# Altium project tsac-distribution.PrjPcb (part 2 of 2)

## Sheet tsal-logic.SchDoc: tsal-logic
size A4; Date: 05.10.2017; CheckedBy: Nico Bieberich; Author: Leon Loeser; Organization: Baltic Racing; Address1: Zur Schwedenschanze 15; Address2: Haus 18; Address3: 18435 Stralsund; Revision: xx.xx; SheetNumber: 4; SheetTotal: 9; Rules: EV4.10; ProjectName: Projekt
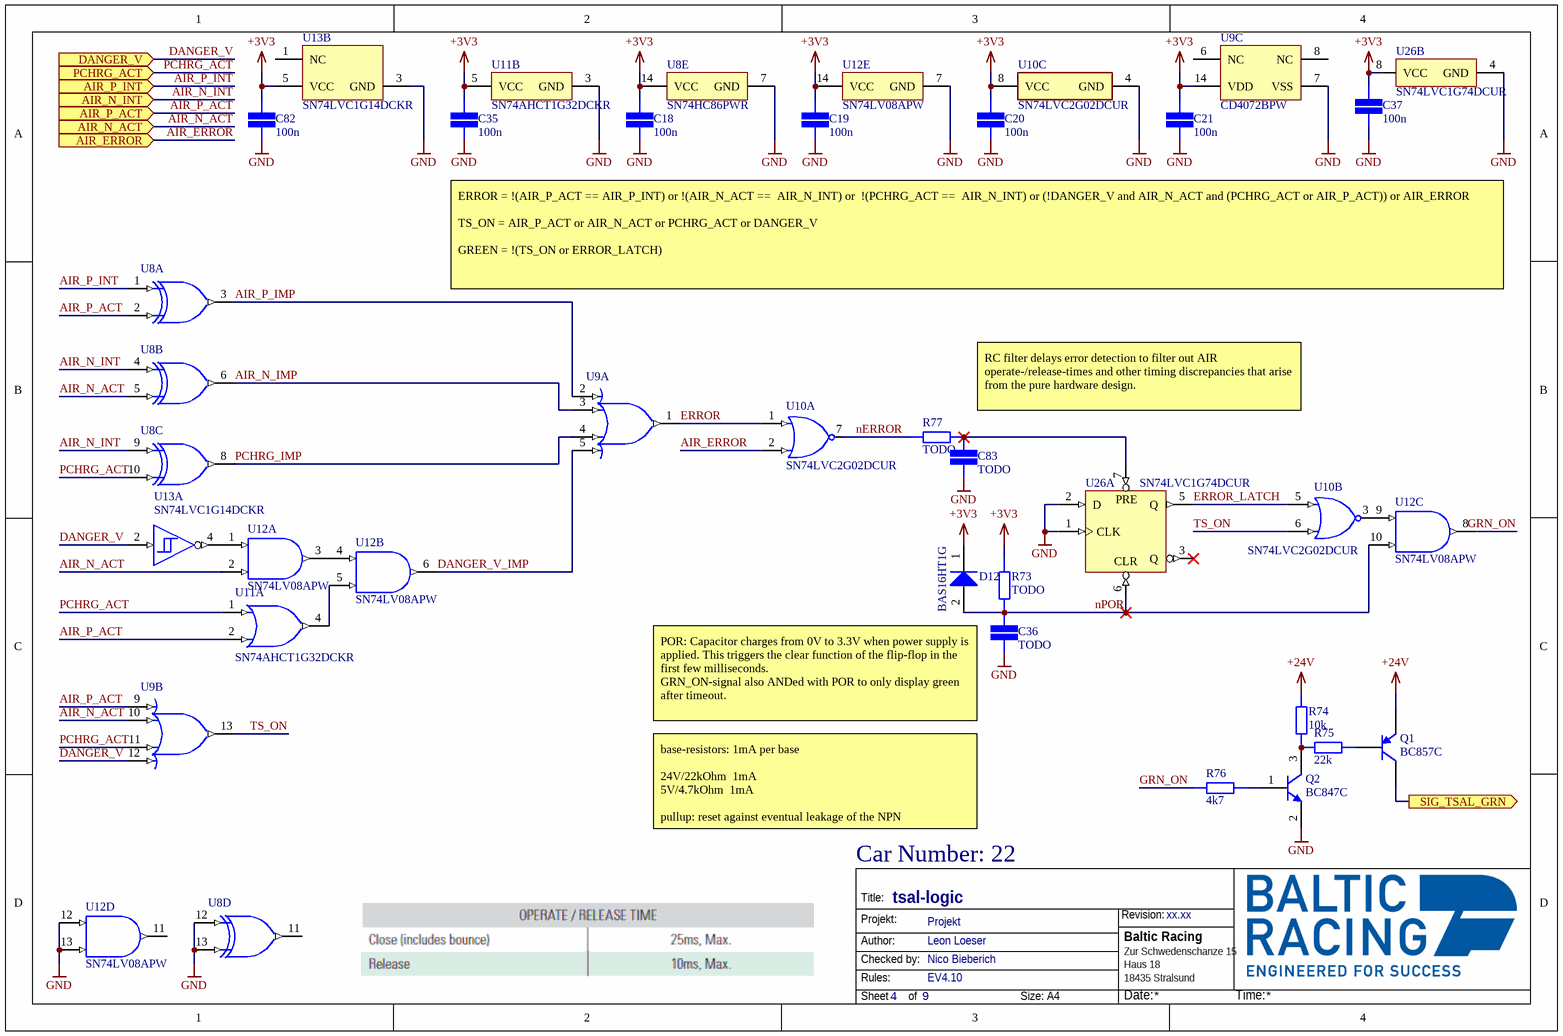
[diagram p6: tsal-logic.SchDoc]

### Parts
C18  value 100n  [CAP 0603/1608]  (hidden comment: SMD Capacitor)
C19  value 100n  [CAP 0603/1608]  (hidden comment: SMD Capacitor)
C20  value 100n  [CAP 0603/1608]  (hidden comment: SMD Capacitor)
C21  value 100n  [CAP 0603/1608]  (hidden comment: SMD Capacitor)
C35  value 100n  [CAP 0603/1608]  (hidden comment: SMD Capacitor)
C36  value TODO  [CAP 1206/3216]  (hidden comment: SMD Capacitor)
C37  value 100n  [CAP 0603/1608]  (hidden comment: SMD Capacitor)
C82  value 100n  [CAP 0603/1608]  (hidden comment: SMD Capacitor)
C83  value TODO  [CAP 1206/3216]  (hidden comment: SMD Capacitor)
D12  BAS16HT1G  [ONSC-SOD-323-2-477-02_V]
Q1  BC857C  [INF-SOT23_N]
Q2  BC847C  [INF-SOT23_L]
R73  value TODO  [STACKPOLE CSR0603]  (hidden comment: SMD Resistor)
R74  value 10k  [STACKPOLE CSR0603]  (hidden comment: SMD Resistor)
R75  value 22k  [STACKPOLE CSR0603]  (hidden comment: SMD Resistor)
R76  value 4k7  [STACKPOLE CSR0603]  (hidden comment: SMD Resistor)
R77  value TODO  [STACKPOLE CSR0603]  (hidden comment: SMD Resistor)
U8  SN74HC86PWR  [PW0014A_M]  (value not drawn)  (parts A,B,C,D,E of 5)
U9  CD4072BPW  [PW0014A_M]  (value not drawn)  (parts A,B,C of 3)
U10  SN74LVC2G02DCUR  [FP-DCU0008A-MFG]  (parts A,B,C of 3)
U11  SN74AHCT1G32DCKR  [DCK0005A_M]  (parts A,B of 2)
U12  SN74LV08APW  [PW0014A_N]  (parts A,B,C,D,E of 5)
U13  SN74LVC1G14DCKR  [DCK0005A_L]  (parts A,B of 2)
U26  SN74LVC1G74DCUR  [DCU0008A_L]  (parts A,B of 2)

### Ports
AIR_ERROR (in), AIR_N_ACT (in), AIR_N_INT (in), AIR_P_ACT (in), AIR_P_INT (in), DANGER_V (in), PCHRG_ACT (in), SIG_TSAL_GRN (out)

### Nets
+3V3: C18.1 C19.1 C20.1 C21.1 C35.1 C37.1 C82.1 D12.1(K) R73.2 U8.14(VCC) U9.14(VDD) U10.8(VCC) U11.5(VCC) U12.14(VCC) U13.5(VCC) U26.8(VCC)
+24V: Q1.2(E) R74.1
GND: C18.2 C19.2 C20.2 C21.2 C35.2 C36.1 C37.2 C82.2 C83.1 Q2.2(E) U8.7(GND) U8.12(4A) U8.13(4B) U9.7(VSS) U10.4(GND) U11.3(GND) U12.7(GND) U12.12(4A) U12.13(4B) U13.3(GND) U26.1(CLK) U26.2(D) U26.4(GND)
AIR_ERROR: U10.2(1B) ; port AIR_ERROR
AIR_N_ACT: U8.5(2B) U9.10(F) U12.2(1B) ; port AIR_N_ACT
AIR_N_IMP: U8.6(2Y) U9.3(B)
AIR_N_INT: U8.4(2A) U8.9(3A) ; port AIR_N_INT
AIR_P_ACT: U8.2(1B) U9.9(E) U11.2(B) ; port AIR_P_ACT
AIR_P_IMP: U8.3(1Y) U9.2(A)
AIR_P_INT: U8.1(1A) ; port AIR_P_INT
DANGER_V: U9.12(H) U13.2(A) ; port DANGER_V
DANGER_V_IMP: U9.5(D) U12.6(2Y)
ERROR: U9.1(J) U10.1(1A)
ERROR_LATCH: U10.5(2A) U26.5(Q)
GRN_ON: R76.2 U12.8(3Y)
nERROR: R77.2 U10.7(1Y)
nPOR: C36.2 D12.2(A) R73.1 U12.10(3B) U26.6(~{CLR})
PCHRG_ACT: U8.10(3B) U9.11(G) U11.1(A) ; port PCHRG_ACT
PCHRG_IMP: U8.8(3Y) U9.4(C)
SIG_TSAL_GRN: Q1.3(C) ; port SIG_TSAL_GRN
TS_ON: U9.13(K) U10.6(2B)
NetC83_2: C83.2 R77.1 U26.7(~{PRE})
NetQ1_1: Q1.1(B) R75.1
NetQ2_1: Q2.1(B) R76.1
NetQ2_3: Q2.3(C) R74.2 R75.2
NetU10_3: U10.3(2Y) U12.9(3A)
NetU11_4: U11.4(Y) U12.5(2B)
NetU12_1: U12.1(1A) U13.4(Y)
NetU12_3: U12.3(1Y) U12.4(2A)

Not connected (* = marked no-connect by the designer): U8 11(4Y); U9 6(NC) 8(NC); U12 11(4Y); U13 1(NC); U26 3(Q)*

### Notes on the sheet
- ERROR = !(AIR_P_ACT == AIR_P_INT) or !(AIR_N_ACT ==  AIR_N_INT) or  !(PCHRG_ACT ==  AIR_N_INT) or (!DANGER_V and AIR_N_ACT and (PCHRG_ACT or AIR_P_ACT)) or AIR_ERROR
  TS_ON = AIR_P_ACT or AIR_N_ACT or PCHRG_ACT or DANGER_V
  GREEN = !(TS_ON or ERROR_LATCH)
- RC filter delays error detection to filter out AIR operate-/release-times and other timing discrepancies that arise from the pure hardware design.
- POR: Capacitor charges from 0V to 3.3V when power supply is applied. This triggers the clear function of the flip-flop in the first few milliseconds.
  GRN_ON-signal also ANDed with POR to only display green after timeout.
- base-resistors: 1mA per base
  24V/22kOhm  1mA
  5V/4.7kOhm  1mA
  pullup: reset against eventual leakage of the NPN
- Car Number: 22
- Title:
- Projekt:
- Revision:
- Author:
- Rules:
- Checked by:
- Sheet
- of
- Size:
- A4
- Date:
- Time:
- (in symbol CMP-0859-00701-3, part A) PRE; CLR

### Library data of the parts
C18-C21 C35-C37 C82 C83 = SMD Capacitor: as C53 on sheet tsac-distribution
D12 = CMP-1054-00068-1: Switching Diode, 2-Pin SOD-323, Pb-Free, Tape and Reel; Manufacturer: On Semiconductor; Configuration: Single; IF Max (A): 0.2; trr Max (ns): 6; Packing: Tape and Reel; ComponentLink2URL: http://www.onsemi.com/pub_link/Collateral/BAS16HT1-D.PDF; ComponentLink3Description: Package Specification; RoHS: TRUE; PackageDescription: 2-Pin SOD, Body 1.7 x 1.25 mm; PackageReference: SOD-323-2-477-02; PartNumber: BAS16HT1G; ComponentLink1URL: http://www.onsemi.com/; Mounting Technology: Surface Mount; ComponentLink1Description: Manufacturer URL; ComponentLink2Description: Datasheet; DatasheetVersion: Rev. 11; PackageVersion: Rev. H, 03/2007; ComponentLink3URL: http://www.onsemi.com/pub_link/Collateral/477-02.PDF.1
Q1 = CMP-1177-00039-1: PNP Silicon AF Transistor, 45 V VCEO, 100 mA IC, SOT23, Reel, Green; Manufacturer: Infineon; VCBO (max): 50Â V; fT (typ): 250Â MHz; ICBO (max): 15Â nA; IC (max): 100Â mA; Green: TRUE; IBM (max): 200Â mA; VEBO (max): 5Â V; VCEO (max): 45Â V; Ptot (max): 330Â mW; PackageDescription: 3-Pin Small Outline Transistor Package, 1.3 x 2.9 mm Body, 0.95 mm Pitch; ComponentLink2Description: Datasheet; PackageReference: SOT23; ComponentLink3Description: Package Specification; ComponentLink1URL: http://www.infineon.com/; ComponentLink1Description: Manufacturer URL; Mounting Technology: Surface Mount; PackageVersion: Apr-08; ComponentLink3URL: http://www.infineon.com/dgdl/SOT23-Package_Overview.pdf?folderId=db3a30431936bc4b0119532290053c66&fileId=db3a30431936bc4b0119533468123c85; ComponentLink2URL: http://www.infineon.com/dgdl/bc857series_bc858series_bc859series_bc860series.pdf?folderId=db3a304314dca389011541d30fa21656&fileId=db3a304314dca389011541da0e3a1661; Polarity: PNP; ICM (max): 200Â mA; PartNumber: BC857C; Packing: Reel
Q2 = CMP-1177-00037-1: NPN Silicon AF Transistor, 45 V VCEO, 100 mA IC, SOT23, Reel, Green; Manufacturer: Infineon; VCEO (max): 45Â V; VEBO (max): 6Â V; fT (typ): 250Â MHz; VCBO (max): 50Â V; ICM (max): 200Â mA; Green: TRUE; IC (max): 100Â mA; Ptot (max): 330Â mW; ICBO (max): 15Â nA; PartNumber: BC847C; ComponentLink3URL: http://www.infineon.com/dgdl/SOT23-Package_Overview.pdf?folderId=db3a30431936bc4b0119532290053c66&fileId=db3a30431936bc4b0119533468123c85; ComponentLink3Description: Package Specification; Mounting Technology: Surface Mount; PackageDescription: 3-Pin Small Outline Transistor Package, 1.3 x 2.9 mm Body, 0.95 mm Pitch; PackageReference: SOT23; ComponentLink2URL: http://www.infineon.com/dgdl/bc847series_bc848series_bc849series_bc850series.pdf?folderId=db3a304314dca389011541d30fa21656&fileId=db3a304314dca389011541d4630a1657; ComponentLink2Description: Datasheet; ComponentLink1Description: Manufacturer URL; Polarity: NPN; ComponentLink1URL: http://www.infineon.com/; IBM (max): 200Â mA; Packing: Reel; PackageVersion: Apr-08
R73-R77 = SMD Resistor: Resistor with multiple footprints
U8 = CMP-0778-00135-3: Quadruple 2-Input Exclusive-OR Gates, PW0014A, LARGE T&R; Manufacturer: Texas Instruments; Technology Family: HC; tpd @ Nom Voltage(Max)(ns): 21; Schmitt Trigger: No; Bits(#): 4; Output Drive (IOL/IOH)(Max)(mA): 5.2/-5.2; Rating: Catalog; Input Type: CMOS; Voltage(Nom)(V): 5; ICC @ Nom Voltage(Max)(mA): 0.02; VCC(Min)(V): 2; VCC(Max)(V): 6; F @ Nom Voltage(Max)(Mhz): 70; Generic Part Number: SN74HC86; Operating Temperature Range(C): -40 to 85; PackageReference: PW0014A; DatasheetVersion: SCLS100E; Output Type: CMOS
U9 = CMP-1573-00202-3: CMOS Dual 4-Input OR Gate, PW0014A, TUBE; Manufacturer: Texas Instruments; Voltage(Nom)(V): 10; tpd @ Nom Voltage(Max)(ns): 120; Rating: Catalog; VCC(Max)(V): 18; ICC @ Nom Voltage(Max)(mA): 0.015; VCC(Min)(V): 3; Output Drive (IOL/IOH)(Max)(mA): 1.5/-1.5; F @ Nom Voltage(Max)(Mhz): 8; Bits(#): 2; Code_JEDEC: MO-153; Output Type: CMOS; Input Type: CMOS; PackageReference: PW0014A; Generic Part Number: CD4072B; Operating Temperature Range(C): -55 to 125; DatasheetVersion: SCHS056D; PackageVersion: http://www.ti.com/lit/ml/mpds360/mpds360.pdf
U10 = CMP-0859-00696-4: NOR Gate IC 2 Channel  8-VSSOP; Manufacturer: Texas Instruments; Max Supply Voltage: 5.5V; Number Of Circuits: 2; Nominal Supply Current: 10uA; Number Of Outputs: 1; Standoff Height: 0mm; Max Junction Temp: +150°C; Min Supply Voltage: 1.65V; Propagation Delay: 5.4ns; Frequency: 100MHz; RoHS: TRUE; Device Class L2: Logic ICs; Device Class L3: Logic Gates; Device Class L1: Integrated Circuits (ICs); Manufacturer Part Number: SN74LVC2G02DCUR; Automotive: No; Octopart: https://octopart.com/sn74lvc2g02dcur-texas+instruments-464558; Logic Function Desc: NOR; Temperature Range Low: -40°C; Number Of Inputs: 2; Ambient Temperature Range High: +125°C; Package: DCU0008A; ComponentLink2Description: Datasheet; Mouser Description: Dual 2-Input Positive-NOR Gate 8-VSSOP -40 to 125; Ambient Temperature Range Low: -40°C; Category: IC; Temperature Range High: +125°C; Temperature: -40°C to +125°C; Lead Free: Yes; ComponentLink2URL: http://www.ti.com/lit/ds/symlink/sn74lvc2g02.pdf; Height: 0.9mm; Digikey Description: NOR Gate IC 2 Channel  8-VSSOP
U11 = CMP-0859-00275-3: Single 2-Input Positive-OR Gate, DCK0005A, LARGE T&R; Manufacturer: Texas Instruments; Logic: True; Output Drive (IOL/IOH)(Max)(mA): 8/-8; VCC(Min)(V): 2; Input Type: CMOS; ICC @ Nom Voltage(Max)(mA): 0.01; tpd @ Nom Voltage(Max)(ns): 8; Bits(#): 1; Voltage(Nom)(V): 5; VCC(Max)(V): 5.5; Technology Family: AHCT; Rating: Catalog; Sub-Family: OR Gate; Gate Type: OR; F @ Nom Voltage(Max)(Mhz): 75; 3-State Output: No; PackageReference: DCK0005A; Output Type: CMOS; DatasheetVersion: SCLS320O; Operating Temperature Range(C): -40 to 125; Generic Part Number: SN74AHCT1G32; Schmitt Trigger: No
U12 = CMP-0777-00327-3: Quadruple 2-Input Positive-AND Gates, PW0014A, TUBE; Manufacturer: Texas Instruments; Output Type: TTL; VCC(Min)(V): 2; Schmitt Trigger: No; Bits(#): 4; Rating: Catalog; F @ Nom Voltage(Max)(Mhz): 70; Output Drive (IOL/IOH)(Max)(mA): -50/50; tpd @ Nom Voltage(Max)(ns): 16,10.5,7; Voltage(Nom)(V): 2.5,3.3,5; VCC(Max)(V): 5.5; ICC @ Nom Voltage(Max)(mA): 0.02; Technology Family: LV-A; DatasheetVersion: SCLS387M; Input Type: TTL; PackageReference: PW0014A; Operating Temperature Range(C): -40 to 125,-40 to 85; Generic Part Number: SN74LV08A
U13 = CMP-0859-00440-4: Single Schmitt-Trigger Inverter, DCK0005A, LARGE T&R; Manufacturer: Texas Instruments; Output Drive (IOL/IOH)(Max)(mA): 32/-32; Schmitt Trigger: Yes; Logic: Inverting; Bits(#): 1; Rating: Catalog; tpd @ Nom Voltage(Max)(ns): 11,6.5,5.5,5; Voltage(Nom)(V): 1.8,2.5,3.3,5; Output Type: CMOS; VCC(Min)(V): 1.65; ICC @ Nom Voltage(Max)(mA): 0.01; Input Type: CMOS/TTL; F @ Nom Voltage(Max)(Mhz): 150; VCC(Max)(V): 5.5; Sub-Family: Inverting Buffer/Driver; 3-State Output: No; Technology Family: LVC; PackageReference: DCK0005A; Operating Temperature Range(C): -40 to 125,-40 to 85; Generic Part Number: SN74LVC1G14; DatasheetVersion: SCES218W
U26 = CMP-0859-00701-3: Single Positive-Edge-Triggered D-Type Flip-Flop With Clear and Preset, DCU0008A, LARGE T&R; Manufacturer: Texas Instruments; Rating: Catalog; Technology Family: LVC; Output Type: CMOS; VCC(Max)(V): 5.5; ICC @ Nom Voltage(Max)(mA): 0.01; Output Drive (IOL/IOH)(Max)(mA): 32/-32; 3-State Output: No; VCC(Min)(V): 1.65; Input Type: CMOS/TTL; Logic: True; Bits(#): 1; Voltage(Nom)(V): 1.8,2.5,3.3,5; tpd @ Nom Voltage(Max)(ns): 13.4,7.1,5.9,4.1; F @ Nom Voltage(Max)(Mhz): 150; PackageReference: DCU0008A; Sub-Family: D-Type Flip-Flop; Schmitt Trigger: No; DatasheetVersion: SCES794E; Generic Part Number: SN74LVC1G74; Operating Temperature Range(C): -40 to 125

## Sheet precharge.SchDoc: precharge
size A4; Date: 05.10.2017; CheckedBy: Nico Bieberich; Author: Leon Loeser; Organization: Baltic Racing; Address1: Zur Schwedenschanze 15; Address2: Haus 18; Address3: 18435 Stralsund; Revision: xx.xx; SheetNumber: 6; SheetTotal: 9; Rules: EV5.7; ProjectName: Projekt
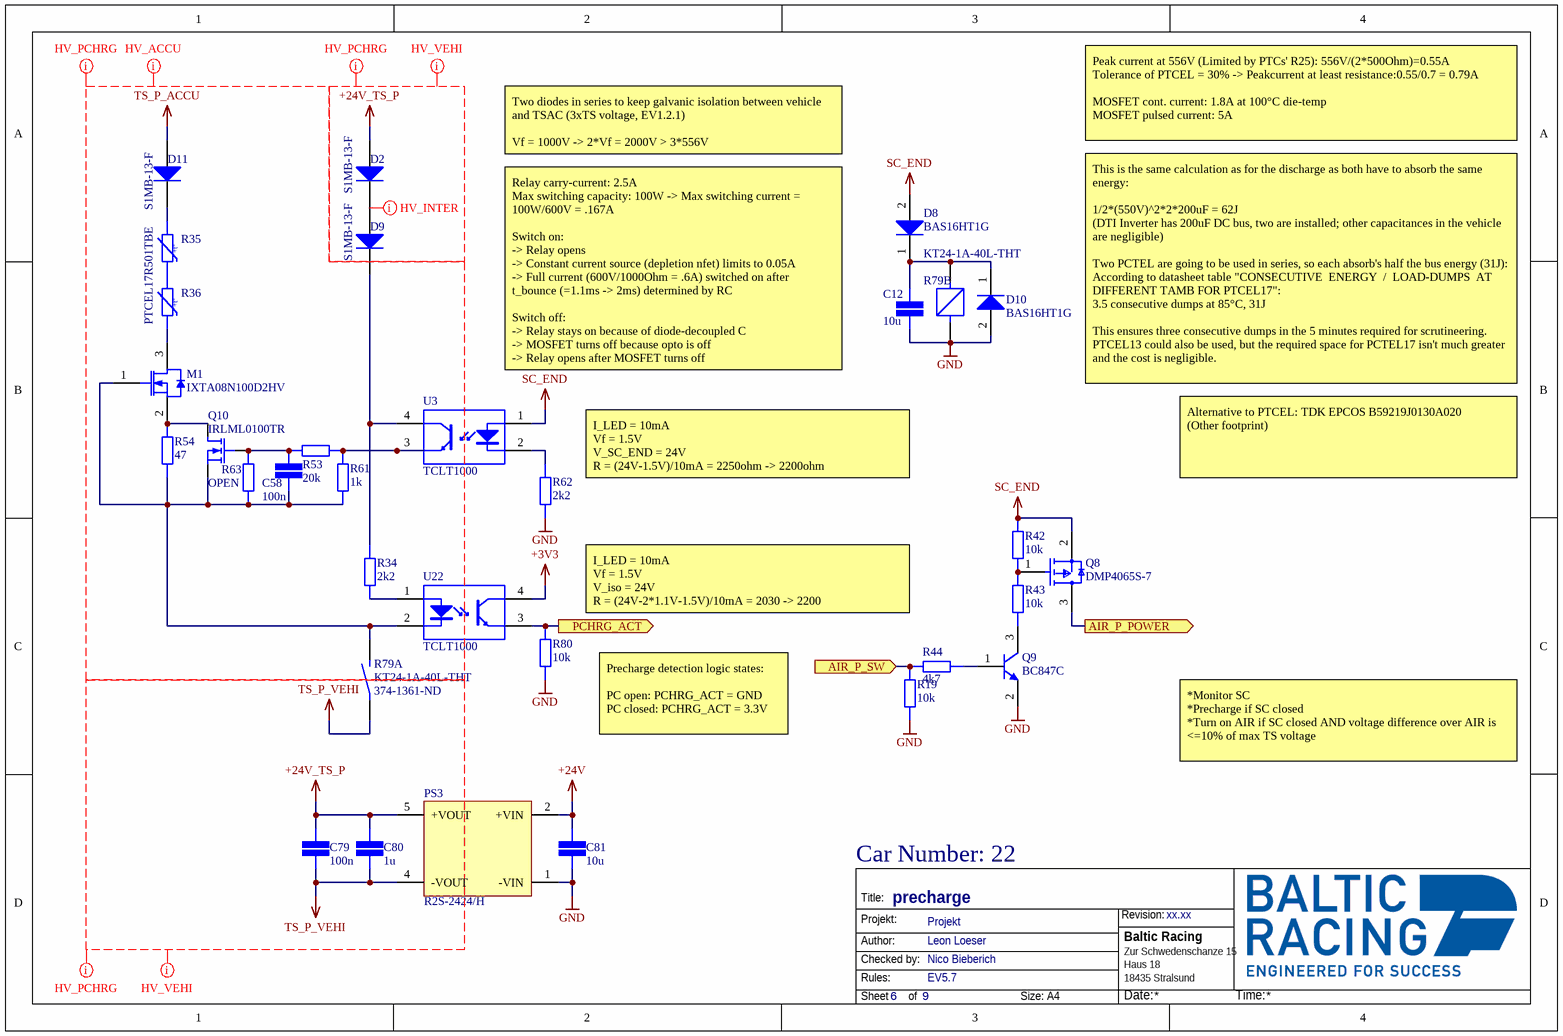
[diagram p7: precharge.SchDoc]

### Parts
C12  value 10u  [CAP 1206/3216]  (hidden comment: SMD Capacitor)
C58  value 100n  [CAP 0603/1608]  (hidden comment: SMD Capacitor)
C79  value 100n  [CAP 0603/1608]  (hidden comment: SMD Capacitor)
C80  value 1u  [CAP 0805/2012]  (hidden comment: SMD Capacitor)
C81  value 10u  [CAP 1206/3216]  (hidden comment: SMD Capacitor)
D2  S1MB-13-F  [DIOD-SMB-2_V]
D8  BAS16HT1G  [ONSC-SOD-323-2-477-02_V]
D9  S1MB-13-F  [DIOD-SMB-2_V]
D10  BAS16HT1G  [ONSC-SOD-323-2-477-02_V]
D11  S1MB-13-F  [DIOD-SMB-2_V]
M1  IXTA08N100D2HV  [IXYS_TO-263HV]
PS3  R2S-2424/H  [RECOM_R2S]
Q8  DMP4065S-7  [FP-SOT23-MFG]
Q9  BC847C  [INF-SOT23_L]
Q10  IRLML0100TR  [SOT23]
R19  value 10k  [STACKPOLE CSR0603]  (hidden comment: SMD Resistor)
R34  value 2k2  [STACKPOLE CSR0603]  (hidden comment: SMD Resistor)
R35  PTCEL17R501TBE  [PTCEL17]
R36  PTCEL17R501TBE  [PTCEL17]  (value not drawn)
R42  value 10k  [STACKPOLE CSR0603]  (hidden comment: SMD Resistor)
R43  value 10k  [STACKPOLE CSR0603]  (hidden comment: SMD Resistor)
R44  value 4k7  [STACKPOLE CSR0603]  (hidden comment: SMD Resistor)
R53  value 20k  [STACKPOLE CSR0603]  (hidden comment: SMD Resistor)
R54  value 47  [STACKPOLE CSR0603]  (hidden comment: SMD Resistor)
R61  value 1k  [STACKPOLE CSR0603]  (hidden comment: SMD Resistor)
R62  value 2k2  [STACKPOLE CSR0603]  (hidden comment: SMD Resistor)
R63  value OPEN  [STACKPOLE CSR0603]  (hidden comment: SMD Resistor)
R79  KT24-1A-40L-THT  Supplier Part Number 1: 374-1361-ND  [STANDEX_KT_THT]  (parts A,B of 2)
R80  value 10k  [STACKPOLE CSR0603]  (hidden comment: SMD Resistor)
U3  TCLT1000  [VISH-SOP4L-4_V]
U22  TCLT1000  [VISH-SOP4L-4_V]

### Ports
AIR_P_POWER (out), AIR_P_SW (in), PCHRG_ACT (out)

### Nets
+3V3: U22.4(C)
+24V: C81.2 PS3.2(+VIN)
+24V_TS_P: C79.1 C80.1 D2.1(A) PS3.5(+VOUT)
GND: C12.1 C81.1 D10.2(A) PS3.1(-VIN) Q9.2(E) R19.2 R62.1 R79.4(L2) R80.1
SC_END: D8.2(A) Q8.2(S) R42.1 U3.1(A)
TS_P_ACCU: D11.1(A)
TS_P_VEHI: C79.2 C80.2 PS3.4(-VOUT) R79.1(COM)
AIR_P_POWER: Q8.3(D) ; port AIR_P_POWER
PCHRG_ACT: R80.2 U22.3(E) ; port PCHRG_ACT
NetC12_2: C12.2 D8.1(K) D10.1(K) R79.3(L1)
NetC58_1: C58.1 Q10.1(G) R53.2 R63.2
NetC58_2: C58.2 M1.1(GATE) Q10.2(S) R54.1 R61.1 R63.1 R79.2(NO) U22.2(C)
NetD2_2: D2.2(K) D9.1(A)
NetD9_2: D9.2(K) R34.2 U3.4(C)
NetD11_2: D11.2(K) R35.1
NetM1_2: M1.2(SOURCE) Q10.3(D) R54.2
NetM1_3: M1.3(DRAIN) R36.2
NetQ8_1: Q8.1(G) R42.2 R43.1
NetQ9_1: Q9.1(B) R44.1
NetQ9_3: Q9.3(C) R43.2
NetR19_1: R19.1 R44.2 ; port AIR_P_SW
NetR34_1: R34.1 U22.1(A)
NetR35_2: R35.2 R36.1
NetR53_1: R53.1 R61.2 U3.3(E)
NetR62_2: R62.2 U3.2(C)

### Layout directives
net class HV_PCHRG: +24V_TS_P, TS_P_ACCU, TS_P_VEHI
net class HV_ACCU: TS_P_ACCU
net class HV_VEHI: +24V_TS_P, TS_P_VEHI
net class HV_INTER: NetD2_2

### Notes on the sheet
- Two diodes in series to keep galvanic isolation between vehicle and TSAC (3xTS voltage, EV1.2.1)
  Vf = 1000V -> 2*Vf = 2000V > 3*556V
- Peak current at 556V (Limited by PTCs' R25): 556V/(2*500Ohm)=0.55A
  Tolerance of PTCEL = 30% -> Peakcurrent at least resistance:0.55/0.7 = 0.79A
  MOSFET cont. current: 1.8A at 100°C die-temp
  MOSFET pulsed current: 5A
- Relay carry-current: 2.5A
  Max switching capacity: 100W -> Max switching current = 100W/600V = .167A
  Switch on:
  -> Relay opens
  -> Constant current source (depletion nfet) limits to 0.05A
  -> Full current (600V/1000Ohm = .6A) switched on after t_bounce (=1.1ms -> 2ms) determined by RC
  Switch off:
  -> Relay stays on because of diode-decoupled C
  -> MOSFET turns off because opto is off
  -> Relay opens after MOSFET turns off
  Timing-resistor values based on simulation (in simulation folder)
- This is the same calculation as for the discharge as both have to absorb the same energy:
  1/2*(550V)^2*2*200uF = 62J
  (DTI Inverter has 200uF DC bus, two are installed; other capacitances in the vehicle are negligible)
  Two PCTEL are going to be used in series, so each absorb's half the bus energy (31J):
  According to datasheet table "CONSECUTIVE  ENERGY  /  LOAD-DUMPS  AT DIFFERENT TAMB FOR PTCEL17":
  3.5 consecutive dumps at 85°C, 31J
  This ensures three consecutive dumps in the 5 minutes required for scrutineering. PTCEL13 could also be used, but the required space for PCTEL17 isn't much greater and the cost is negligible.
- (near R62) I_LED = 10mA
  Vf = 1.5V
  V_SC_END = 24V
  R = (24V-1.5V)/10mA = 2250ohm -> 2200ohm
- Alternative to PTCEL: TDK EPCOS B59219J0130A020
  (Other footprint)
- I_LED = 10mA
  Vf = 1.5V
  V_iso = 24V
  R = (24V-2*1.1V-1.5V)/10mA = 2030 -> 2200
- Precharge detection logic states:
  PC open: PCHRG_ACT = GND
  PC closed: PCHRG_ACT = 3.3V
- *Monitor SC
  *Precharge if SC closed
  *Turn on AIR if SC closed AND voltage difference over AIR is <=10% of max TS voltage
- Car Number: 22
- Title:
- Projekt:
- Revision:
- Author:
- Rules:
- Checked by:
- Sheet
- of
- Size:
- A4
- Date:
- Time:
- (in symbol PTCEL17R501TBE) +t°

### Library data of the parts
C12 C81 = SMD Capacitor: Capacitor with multiple Footprints; Voltage: 25V
C58 C79 C80 = SMD Capacitor: as C53 on sheet tsac-distribution
D2 D9 D11 = CMP-2000-07013-1: Surface Mount Glass Passivated Rectifier / , 1 A, 1.1 V, -65 to 150 degC, 2-Pin SMD, RoHS, Tape and Reel; Manufacturer: Diodes Inc; Average Rectified Current-Max: 1A; Forward Voltage: 1.1V; Reverse Current-Max: 5µA; Peak Current-Max: 30A; Reverse Voltage-Max [Vrrm]: 1000V; Manufacturer URL: http://www.diodes.com/; Datasheet URL: http://www.diodes.com/_files/datasheets/ds16003.pdf; Datasheet Version: Rev. 24-2, 12/2014; Package Description: 2-Pin Surface Mount Device, Body 4.315 x 3.62 mm; Package Reference: SMB-2; Mounting Technology: SurfaceMount
D8 D10 = CMP-1054-00068-1: as D12 on sheet tsal-logic; Packing: Tape and Reel; ComponentLink2URL: http://www.onsemi.com/pub_link/Collateral/BAS16HT1-D.PDF; ComponentLink3Description: Package Specification; RoHS: TRUE; PackageDescription: 2-Pin SOD, Body 1.7 x 1.25 mm; PackageReference: SOD-323-2-477-02; PartNumber: BAS16HT1G; ComponentLink1URL: http://www.onsemi.com/; Mounting Technology: Surface Mount; ComponentLink1Description: Manufacturer URL; ComponentLink2Description: Datasheet; DatasheetVersion: Rev. 11; PackageVersion: Rev. H, 03/2007; ComponentLink3URL: http://www.onsemi.com/pub_link/Collateral/477-02.PDF.1
M1 = IXTA08N100D2HV: D2 Series - 100V - 1700V N-Channel Depletion Mode Power MOSFETs, TO-263HV, RoHS; Manufacturer: Littelfuse; Supplier 1: Arrow Electronics; Manufacturer Part Number: IXTA08N100D2HV; RoHS: Yes; Category: MOSFETs; Stock 1: 30; Pricing 1: 1=1,74230, 300=2,14500, 500=1,90100, 1000=1,67700, 2000=1,66000, 2500=1,64400, 3000=1,62700, 4000=1,61100, 5000=1,59500, 10000=1,57900, 20000=1,56300 (USD); Supplier Part Number 1: IXTA08N100D2HV
PS3 = R2S-2424/H: 2W DC/DC-Converter 'ECONOLINE' SMD 3kV unreg; V. In: 24; V. Out: 24; mA. Out: 83; Manufacturer: Recom; Number of Outputs: 1; Efficiency: 85%; Min Input Voltage: 21.6V; Max Input Voltage: 26.4V; Voltage - Output 1: 24V; Max Output Current: 83mA; Isolation: Isolated; Supplier 1: Digi-Key; Manufacturer Part Number: R2S-2424/H; RoHS: Yes; Category: Voltage Regulators - Switching; Stock 1: 519; Pricing 1: 1=15,71000, 5=15,59400, 10=15,47600, 25=15,23760, 50=14,76140, 100=13,33290, 250=13,09480, 440=12,85673 (USD); Mount: Surface Mount; Case/Package: SMD/SMT; Number of Pins: 5; Weight: 1.4g; Min Operating Temperature: -40°C; Max Operating Temperature: 100°C; Packaging: Rail/Tube; Output Power: 2W; Package Quantity: 39; Isolation Voltage: 3kV; Nominal Input Voltage: 24V; Max Power Dissipation: 2W; Max Output Voltage: 24V; Features: SCP; Series: ECONOLINE R2S; Output Voltage: 24V; Output Current: 83mA; Length: 12.75mm; Width: 10.7mm; Height: 8.7mm; Depth: 10.7mm; RoHS Compliant: Yes; Lead Free: Lead Free; ComponentLink1URL: https://datasheet.ciiva.com/6225/r2s-r2d-6225029.pdf?src-supplier=Digi-Key; ComponentLink1Description: Datasheet; Supplier Part Number 1: 945-1769-5-ND
Q8 = CMP-12801-000050-1: MOSFET P-CH 40V 2.4A SOT23; Manufacturer: Diodes Inc.; Number Of Channels: 1; Max Junction Temp: +150°C; Standoff Height: 0.013mm; Power Dissipation: 0.72W; Turn Off Delay Time: 36.3ns; Rthja Max: 171°C/W; Typ Forward Diode Voltage: -0.7V; Max Forward Diode Voltage: -1.2V; Drain To Source Voltage: -40V; Threshold Vgs Min: -1V; Gate To Source Voltage: 20V; Depletion Mode: False; Input Capacitace At Vds: 587pF @ -20V; Drain To Source Resistance: 64mΩ; Turn On Delay Time: 3.6ns; Continuous Drain Current: -2.4A; Pulse Drain Current: -20A; Gate Charge At Vgs: 12.2nC @ -10V; Threshold Vgs Max: -3V; Octopart: https://octopart.com/dmp4065s-7-diodes+inc.-57605044; Footprint Url: https://www.diodes.com/assets/Package-Files/SOT23.pdf; Device Class L2: Transistors; Package: SOT23; Number Of P Channels: 1; ComponentLink2URL: https://www.diodes.com/assets/Datasheets/DMP4065S.pdf; Temperature Range High: +150°C; Device Class L1: Discrete Semiconductors; Temperature Range Low: -55°C; Manufacturer Part Number: DMP4065S-7; ComponentLink2Description: Datasheet; Lead Free: Yes; Temperature: -55°C to +150°C; Drain To Source Breakdown Voltage: -40V; Category: Trans; Height: 1.1mm; Digikey Description: MOSFET P-CH 40V 2.4A SOT23; Ipc Land Pattern Name: SOT92P240X102-3; Device Class L3: MOSFETs; RoHS: TRUE; Mouser Description: Trans MOSFET P-CH 40V 2.4A Automotive 3-Pin SOT-23 T/R; Automotive: No
Q9 = CMP-1177-00037-1: as Q2 on sheet tsal-logic; PartNumber: BC847C; ComponentLink3URL: http://www.infineon.com/dgdl/SOT23-Package_Overview.pdf?folderId=db3a30431936bc4b0119532290053c66&fileId=db3a30431936bc4b0119533468123c85; ComponentLink3Description: Package Specification; Mounting Technology: Surface Mount; PackageDescription: 3-Pin Small Outline Transistor Package, 1.3 x 2.9 mm Body, 0.95 mm Pitch; PackageReference: SOT23; ComponentLink2URL: http://www.infineon.com/dgdl/bc847series_bc848series_bc849series_bc850series.pdf?folderId=db3a304314dca389011541d30fa21656&fileId=db3a304314dca389011541d4630a1657; ComponentLink2Description: Datasheet; ComponentLink1Description: Manufacturer URL; Polarity: NPN; ComponentLink1URL: http://www.infineon.com/; IBM (max): 200Â mA; Packing: Reel; PackageVersion: Apr-08
Q10 = MOSFET N: N-Channel MOSFET / RK7002BMT116: / 250mA, 60Vds, 20Vgs / IRLML0100TR: / 1.6A, 100Vds, 16Vgs
R19 R34 R42-R44 R53 R54 R61-R63 R80 = SMD Resistor: Resistor with multiple footprints
R35 R36 = PTCEL17R501TBE: PTCEL Series 1000 V 500 Ohm ±30 % Radial Inrush Current Limiter PTC Thermistor; Manufacturer: Vishay BCcomponents; Tolerance: 30%; Supplier 1: Mouser; Manufacturer Part Number: PTCEL17R501TBE; RoHS: No; Stock 1: 130; Pricing 1: 1=3,37000, 5=3,30000, 10=3,15000, 25=3,00000, 50=2,70000, 100=2,55000, 200=2,46000, 500=2,25000, 1000=2,17000, 10000=2,17000 (USD); RoHS Compliant: No; ComponentLink1URL: http://www.vishay.com/docs/29165/ptcel.pdf?src-supplier=Digi-Key; ComponentLink1Description: http://www.vishay.com/docs/29165/ptcel.pdf?src-supplier=Digi-Key; Supplier Part Number 1: 594-PTCEL17R501TBE
R79 = STANDEX_KT24-1A-40L-THT: Reed Relay, Kt Series, 24 Vdc, 1.8 Kohm, 1 A, 1 Kv, Spst-No Rohs Compliant: Yes; Manufacturer: Standex-Meder Electronics; Coil Current: 13.3mA; Throw Configuration: SPST; Coil Power: 320mW; Coil Resistance: 1.8kR; Coil Type: Non-Latching; Coil Voltage (DC): 24V; Contact Current Rating: 1A; Supplier 1: Digi-Key; Manufacturer Part Number: KT24-1A-40L-THT; RoHS: No; Category: Uncategorized; Pricing 1: 1=11,88000, 15=11,13533, 30=9,89800, 45=9,40311, 90=8,90822, 240=7,91842, 450=7,42351, 945=6,92860 (USD); Mount: Through Hole; Min Operating Temperature: -40°C; Max Operating Temperature: 100°C; Package Quantity: 15; Packaging: Rail/Tube; Termination: PC Pin; Relay Type: Reed; REACH SVHC: Unknown; RoHS Compliant: No; ComponentLink1URL: https://standexelectronics.com/de/ressourcen/technische-bibliothek/technische-informationen/datasheet-kt-series-reed-relay/; ComponentLink1Description: Datasheet
U3 U22 = CMP-2000-07234-1: Optocoupler, Phototransistor Output, VCEO 70 V, -55 to 100 degC, 4-Pin SOP (SOP4L), RoHS, Tape and Reel; Manufacturer: Vishay/Semiconductor; Maximum Collector Emitter Voltage: 70V; Input Type: DC; Maximum Reverse Voltage: 6V; Maximum Collector Emitter Saturation Voltage: 300mV; Number of Channels per Chip: 1; Maximum Collector Current: 50mA; Maximum Power Dissipation: 250mW; Maximum Forward Voltage: 1.6V; Maximum Input Current: 60mA; Typical Forward Voltage: 1.25V; Minimum Isolation Voltage: 5000Vrms; Maximum Current Transfer Ratio @ Current: 600%; Manufacturer URL: http://www.vishay.com/; Package: 4SOP; Mounting Technology: SurfaceMount; Category: TransistorandPhotovoltaicOutputPhotoCouplers; Datasheet URL: http://www.vishay.com/docs/83515/tclt1000.pdf; Output Type: DC; Operating Temperature: -40to100°C; Package Description: 4-Pin Small Outline Package Integrated Circuit, Body 4.1 x 7.5 mm, Pitch 2.54 mm; Datasheet Version: Rev. 2.9, 12/2015; Package Reference: SOP4L; Packaging: Tape&Reel

## Sheet hv-indicator.SchDoc: hv-indicator
size A4; Date: 05.10.2017; CheckedBy: UNCHECKED; Author: Leon Loeser; Organization: Baltic Racing; Address1: Zur Schwedenschanze 15; Address2: Haus 18; Address3: 18435 Stralsund; Revision: xx.xx; SheetNumber: 9; SheetTotal: 9; Rules: EV5.4.8, EV5.4.9, EV5.4.10; ProjectName: Projekt
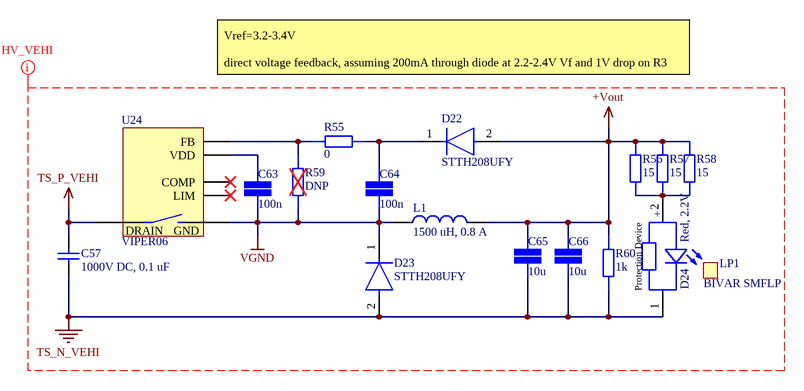
[diagram p8: hv-indicator.SchDoc]

### Parts
C57  1000V DC, 0.1 uF  [WCAP-FTBE_18x8.5x15]
C63  value 100n  [CAP 0603/1608]  (hidden comment: SMD Capacitor)
C64  value 100n  [CAP 0603/1608]  (hidden comment: SMD Capacitor)
C65  value 10u  [CAP 1206/3216]  (hidden comment: SMD Capacitor)
C66  value 10u  [CAP 1206/3216]  (hidden comment: SMD Capacitor)
D22  STTH208UFY  [FP-SMBflat-MFG]
D23  STTH208UFY  [FP-SMBflat-MFG]
D24  Red, 2.2V  [WL-SMDC_3535]
L1  1500 uH, 0.8 A  [WE-PD_1210_Metal base]
LP1  BIVAR SMFLP  [BIVAR_SMFLP]
R55  value 0  [STACKPOLE CSR0603]  (hidden comment: SMD Resistor)
R56  value 15  [STACKPOLE CSR1206]  (hidden comment: SMD Resistor)
R57  value 15  [STACKPOLE CSR1206]  (hidden comment: SMD Resistor)
R58  value 15  [STACKPOLE CSR1206]  (hidden comment: SMD Resistor)
R59  value DNP  [STACKPOLE CSR0603]  (hidden comment: SMD Resistor)
R60  value 1k  [STACKPOLE CSR0603]  (hidden comment: SMD Resistor)
U24  VIPER06  [SSO10_VIPER06]

### Nets
+Vout: C65.2 C66.2 D22.2(A) L1.2 R56.1 R57.1 R58.1 R60.2
TS_N_VEHI: C57.1 C65.1 C66.1 D23.2(A) D24.1(K) R60.1
TS_P_VEHI: C57.2 U24.6(DRAIN)
VGND: C63.1 C64.1 D23.1(K) L1.1 R59.1 U24.1(GND)
NetC63_2: C63.2 U24.2(VDD)
NetC64_2: C64.2 D22.1(K) R55.1
NetD24_2: D24.2(A) R56.2 R57.2 R58.2
NetR55_2: R55.2 R59.2 U24.4(FB)

Not connected (* = marked no-connect by the designer): U24 3(LIM)* 5(COMP)*

### Layout directives
net class HV_VEHI: +Vout, TS_N_VEHI, TS_P_VEHI, VGND

### Notes on the sheet
- Vref=3.2-3.4V
  direct voltage feedback, assuming 200mA through diode at 2.2-2.4V Vf and 1V drop on R3
- Title:
- Projekt:
- Revision:
- Author:
- Rules:
- Checked by:
- Sheet
- of
- Size:
- A4
- Date:
- Time:
- (in symbol 150353RS74500) +; Protection Device

### Library data of the parts
C57 = 890493425009CS: WCAP-FTBE Film Capacitors, 18x8.5x15mm, 1000V DC, 0.1 uF; Value: 0.1 uF; ComponentLink1Description: Manufacturer; ComponentLink1URL: http://www.we-online.de; ComponentLink2Description: Datasheet; ComponentLink2URL: http://katalog.we-online.de/pbs/datasheet/890493425009CS.pdf; Part Number: 890493425009CS; Published Date: Sep. 2017; Publisher: Wurth Elektronik; Rated Voltage: 1000V DC; Size: 18x8.5x15mm; Operating Temperature: -40 °C to +85 °C
C63-C66 = SMD Capacitor: Capacitor with multiple Footprints; Voltage: 6.3V
D22 D23 = CMP-12188-000014-1: DIODE GEN PURP 800V 2A SMBFLAT; Element Configuration: Single; Recovery Time: 53ns; Max Forward Surge Current (Ifsm): 30A; Peak Reverse Current: 5uA; Reverse Recovery Time: 75ns; Forward Voltage: 1.55V; Lead Free: Lead Free; Max Reverse Voltage (DC): 800V; Reverse Voltage (DC): 800V; Min Operating Temperature: -40°C; Max Operating Temperature: 175°C; Package Quantity: 5000; Average Rectified Current: 2A; Max Surge Current: 30A; Packaging: Tape and Reel; Max Repetitive Reverse Voltage (Vrrm): 800V; Mount: Surface Mount; Number of Pins: 2; Forward Current: 2A; REACH SVHC: No SVHC
D24 = 150353RS74500: WL-SMDC SMT Mono-color Ceramic LED Waterclear, size 3535, 2.2V, Red; Manufacturer: Wurth Elektronik; Peak Wavelength: 635nm; Viewing Angle: 125deg; Chip Technology: AlInGaP; ComponentLink1Description: Manufacturer; ComponentLink1URL: http://www.we-online.de; ComponentLink2Description: Datasheet; ComponentLink2URL: https://katalog.we-online.de/led/datasheet/150353RS74500.pdf; Operating Temperature: -40 to +125degC; Emitting Color: Red; Forward Voltage: 2.2V; Manufacturer Part Number: 150353RS74500; Packaging: Tape and Reel; Mounting Technology: SMT; Published Date: October 2019; Size: 3535
L1 = 7447709152: WE-PD SMT Shielded Power Inductor, size 1210, 1500 uH, 0.8 A; Rated Current: 0.8 A; Inductance: 1500 uH; DC Resistance max.: 2.3 Ohm; Self Resonant Frequency: 0.9 MHz; ComponentLink1Description: Manufacturer; ComponentLink1URL: http://www.we-online.de; ComponentLink2Description: Datasheet; ComponentLink2URL: https://katalog.we-online.de/pbs/datasheet/7447709152.pdf; Part Number: 7447709152; Published Date: September 2018; Publisher: Wurth Elektronik; Size: 1210; Operating Temperature: -40 to 125 degC; Mounting Technology: SMT; Packaging: Tape and Reel
LP1 = BIVAR_SMFLP
R55-R60 = SMD Resistor: Resistor with multiple footprints
U24 = VIPER06: Energy saving high voltage converter for direct feedback

## Nets that join several sheets
+3V3: tsac-distribution (C53.1 C54.1 CT1.3 U18.3), air (8 pins), ams (16 pins), hv-measurement (10 pins), imd-monitoring (8 pins), microcontroller (18 pins), tsal-logic (16 pins), precharge (U22.4)
+24V: tsac-distribution (C52.1 C59.2 U18.1), ams (C8.2 C9.2), hv-measurement (C27.2 C34.2 PS1.2 PS2.2), imd-monitoring (C13.2), tsal-logic (Q1.2 R74.1), precharge (C81.2 PS3.2)
GND: tsac-distribution (6 pins), air (11 pins), ams (22 pins), hv-measurement (19 pins), imd-monitoring (13 pins), microcontroller (22 pins), tsal-logic (23 pins), precharge (9 pins)
SC_END: tsac-distribution (C59.6), air (C38.3 D15.1 R50.2), precharge (D8.2 Q8.2 R42.1 U3.1)
TS_N_ACCU: tsac-distribution (C60.1), hv-measurement (7 pins)
TS_N_VEHI: tsac-distribution (C55.1), hv-measurement (7 pins), imd-monitoring (C16.1), hv-indicator (6 pins)
TS_P_ACCU: tsac-distribution (C60.3), hv-measurement (R31.2), precharge (D11.1)
TS_P_VEHI: tsac-distribution (C55.3), hv-measurement (R24.2), imd-monitoring (C16.3), precharge (C79.2 C80.2 PS3.4 R79.1), hv-indicator (C57.2 U24.6)
AIR_ERROR: air (R71.1 U5.1 U5.13), tsal-logic (U10.2)
AIR_N_ACT: air (R67.1 U5.14), microcontroller (U17.37), tsal-logic (U8.5 U9.10 U12.2)
AIR_N_INT: air (R50.1 R51.2), microcontroller (U17.38), tsal-logic (U8.4 U8.9)
AIR_P_ACT: air (R68.1 U5.2), microcontroller (U17.35), tsal-logic (U8.2 U9.9 U11.2)
AIR_P_INT: air (R47.1 R48.2), microcontroller (U17.36), tsal-logic (U8.1)
AIR_P_POWER: air (C38.4 D1.1 R47.2), precharge (Q8.3)
CANRX0: tsac-distribution (CT1.4), microcontroller (U17.61)
CANRX1: ams (CT2.4), microcontroller (U17.33)
CANTX0: tsac-distribution (CT1.1), microcontroller (U17.62)
CANTX1: ams (CT2.1), microcontroller (U17.34)
DANGER_V: hv-measurement (R29.1 U15.6), microcontroller (U17.30), tsal-logic (U9.12 U13.2)
GND_HOOP: tsac-distribution (C59.10), imd-monitoring (C13.4)
IMD_SC_CLOSED: imd-monitoring (D14.2 Q3.2 R22.1 R45.2), microcontroller (U17.21)
IMD_STATE: imd-monitoring (R3.1 R15.1 R17.2), microcontroller (U17.17)
NetD3_2: ams (D3.2 R4.2), microcontroller (U17.24)
NetD4_1: ams (D4.1), microcontroller (U17.25)
NetD5_1: ams (D5.1), microcontroller (U17.23)
NetD7_1: ams (D7.1 R9.1), microcontroller (U17.22)
NetQ4_3: ams (Q6.2 R39.1), imd-monitoring (Q4.3)
NetQ6_3: ams (Q6.3), microcontroller (Q11.2 R65.1)
NetR19_1: microcontroller (U17.39), precharge (R19.1 R44.2)
PCHRG_ACT: microcontroller (U17.54), tsal-logic (U8.10 U9.11 U11.1), precharge (R80.2 U22.3)
SC_IN: tsac-distribution (C59.8), imd-monitoring (Q4.2 R37.1)
SC_OUT: tsac-distribution (C59.7), microcontroller (Q11.3)
SIG_TSAL_GRN: tsac-distribution (C59.9), tsal-logic (Q1.3)
SPI3_MISO: ams (R1.1 U1.3), microcontroller (U17.52)
SPI3_MOSI: ams (U1.2), microcontroller (U17.53)
SPI3_NSS: ams (U1.5), microcontroller (U17.50)
SPI3_SCK: ams (U1.4), microcontroller (U17.51)
V_ACCU: hv-measurement (C70.1 R32.1), microcontroller (U17.9)
V_VEHI: hv-measurement (C28.1 R27.1 U15.3), microcontroller (U17.8)
WDI: ams (U4.7), microcontroller (U17.20)

## Assembly variants
IMD_HS: not fitted R3
IMD_LS: not fitted R17